# EAGLE design Squid_Leg_Controller (EAGLE 6.4)
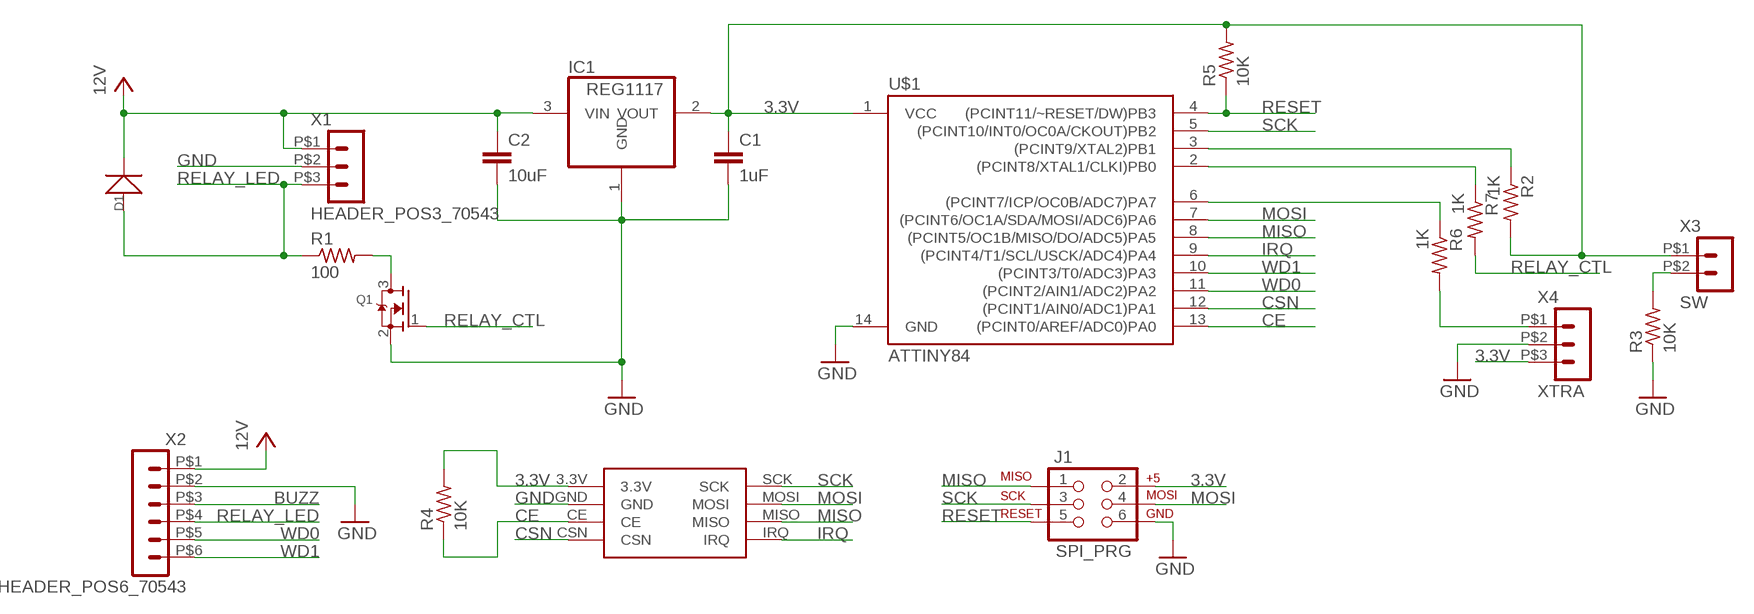
[diagram p0: schematic, sheet 1]

## Parts
C1  1uF  CAP0805  [0805]
C2  10uF  CAP1206  [1206]
D1  D-SMA  [DO-214AC]
IC1  REG1117  [SOT223]
J1  SPI_PRG  AVR_SPI_PRG_62X3_LOCK  [2X3_LOCK]
Q1  MOSFET-NREFLOW  [SOT23]
R1  100  R-US_R0603  [R0603]
R2  1K  R-US_R0603  [R0603]
R3  10K  R-US_R0603  [R0603]
R4  10K  R-US_R0603  [R0603]
R5  10K  R-US_R0603  [R0603]
R6  1K  R-US_R0603  [R0603]
R7  1K  R-US_R0603  [R0603]
U$1  ATTINY84  [SO14]
U$4  NRF24L01+  NRF24L01+_MODULEOFF_BOARD  [NRF24L01+_MODULE_OFFBRD]
X1  HEADER_POS3_70543  [70543-POS3]
X2  HEADER_POS6_70543  [70543-POS6]
X3  SW  HEADER_POS2_70543  [70543-POS2]
X4  XTRA  HEADER_POS3_70543  [70543-POS3]

## Nets
3.3V: C1.1 IC1.2(VOUT) J1.2 R2.2 R4.2 R5.2 U$1.1(VCC) U$4.3.3V X3.P$1 X4.P$3
BUZZ: X2.P$3
CE: R4.1 U$1.13((PCINT0/AREF/ADC0)PA0) U$4.CE
CSN: U$1.12((PCINT1/AIN0/ADC1)PA1) U$4.CSN
GND: C1.2 C2.2 IC1.1(GND) J1.6 Q1.2(S) R3.1 U$1.14(GND) U$4.GND X1.P$2 X2.P$2 X4.P$2
IRQ: U$1.9((PCINT4/T1/SCL/USCK/ADC4)PA4) U$4.IRQ
MISO: J1.1 U$1.8((PCINT5/OC1B/MISO/DO/ADC5)PA5) U$4.MISO
MOSI: J1.4 U$1.7((PCINT6/OC1A/SDA/MOSI/ADC6)PA6) U$4.MOSI
N$1: R2.1 U$1.3((PCINT9/XTAL2)PB1)
N$2: R3.2 X3.P$2
N$3: R6.1 U$1.6((PCINT7/ICP/OC0B/ADC7)PA7)
N$4: R7.1 U$1.2((PCINT8/XTAL1/CLKI)PB0)
N$5: Q1.3(D) R1.2
N$6: R6.2 X4.P$1
RELAY_CTL: Q1.1(G) R7.2
RELAY_LED: D1.1(+) R1.1 X1.P$3 X2.P$4
RESET: J1.5 R5.1 U$1.4((PCINT11/~RESET/DW)PB3)
SCK: J1.3 U$1.5((PCINT10/INT0/OC0A/CKOUT)PB2) U$4.SCK
VCC: C2.1 D1.2(-) IC1.3(VIN) X1.P$1 X2.P$1 ; supply symbol labelled 12V
WD0: U$1.11((PCINT2/AIN1/ADC2)PA2) X2.P$5
WD1: U$1.10((PCINT3/T0/ADC3)PA3) X2.P$6

## Library data of the parts
C1 C2 = SparkFun-Capacitors:CAP: Capacitor Standard 0603 ceramic capacitor, and 0.1" leaded capacitor.
D1 = OPL Eagle Library:D*: DIODE
IC1 = burr-brown:REG1117: 800mA and 1A Low Dropout (LDO) Positive Regulator 1.8V, 2.5V, 2.85V, 3.3V, 5V, and Adj; MPN: REG1117; OC_FARNELL: 1097566; OC_NEWARK: 14P6981
J1 = SparkFun-Connectors:AVR_SPI_PRG_6: AVR ISP 6 Pin This is the reduced ISP connector for AVR programming. Common on Arduino. This footprint will take up less PCB space and can be used with a 10-pin to 6-pin adapter such as SKU: BOB-08508
Q1 = adafruit:MOSFET-N: N-Channel Mosfet 2N7002E - 60V 260mA SOT23 [Digikey: 2N7002ET1GOSTR-ND] - REEL BSH103 - 30V 850mA SOT23 [Digikey: 568-5013-1-ND]
R1-R7 = resistor:R-US_: RESISTOR, American symbol
U$1 = SparkFun-DigitalIC:ATTINY84: Atmel 14-pin 2/4/8kB flash uC
U$4 = Derp - RF:NRF24L01+_MODULE
X1 X4 = Derp - Connectors - Molex SL:HEADER_POS3_?: Molex -C-Grid® / SL Series connector Wire-to-Board 2.54 mm (0.100") pitch header, 3 positions.
X2 = Derp - Connectors - Molex SL:HEADER_POS6_?: Molex -C-Grid® / SL Series connector Wire-to-Board 2.54 mm (0.100") pitch header, 6 positions.
X3 = Derp - Connectors - Molex SL:HEADER_POS2_?: Molex -C-Grid® / SL Series connector Wire-to-Board 2.54 mm (0.100") pitch header, 2 positions.

## Board
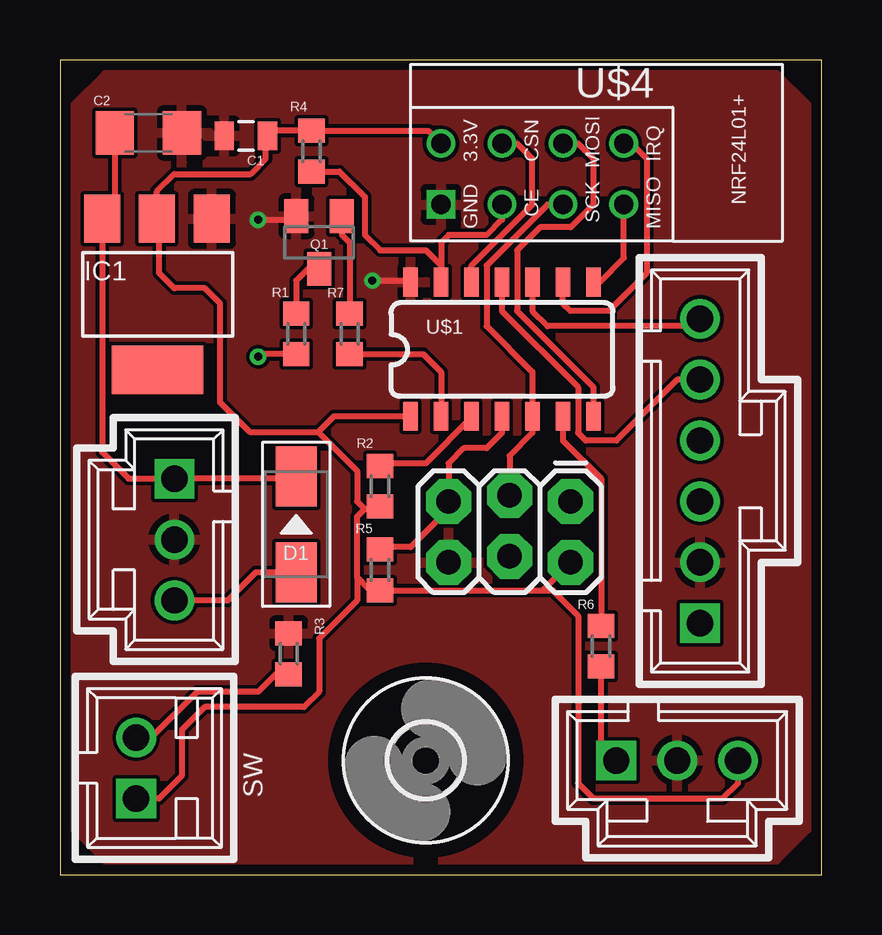
[diagram p1: board, top side]
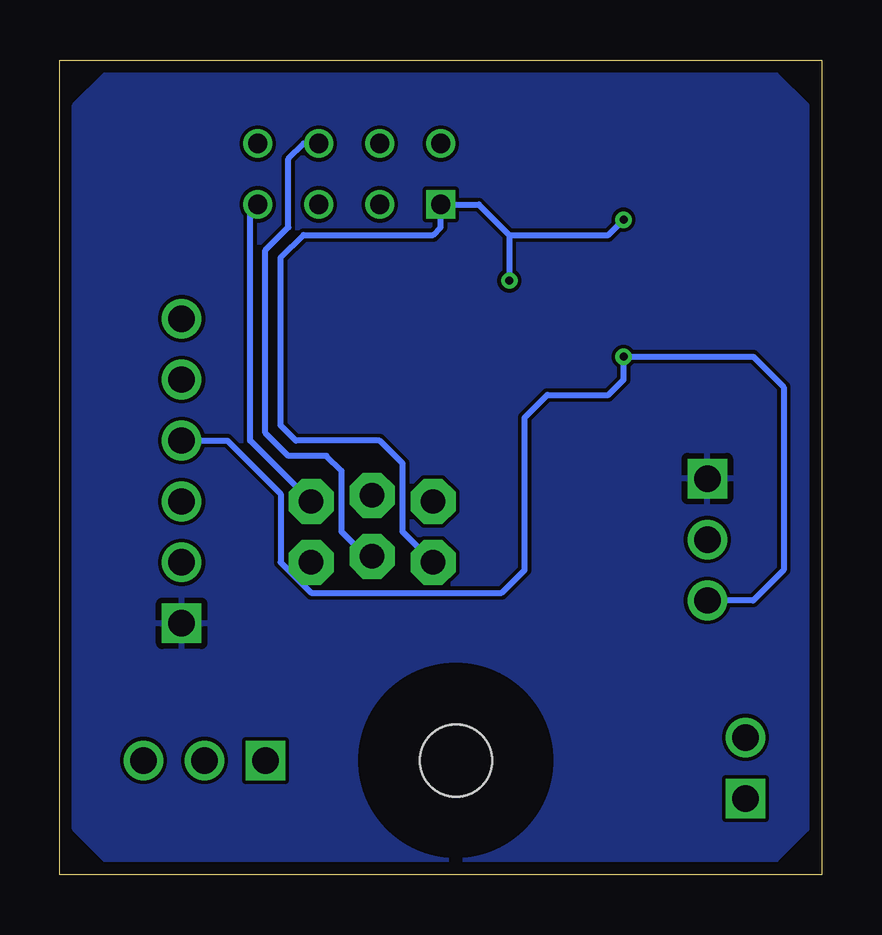
[diagram p2: board, bottom side, seen from below]

Size 31.74 x 33.96 mm. Coordinates in mm from the lower left corner, seen from the top.
Outline: 0,0 31.74,0 31.74,33.96 0,33.96 0,0
Copper layers (1*16): Top 0.0356mm / dielectric 1.5011mm / Bottom 0.0356mm
Design rules "OSHPark": minimum track width 6mil, minimum drill 13mil, track to track 6mil, track to pad 6mil, pad to pad 6mil, via to via 6mil, smd to smd 6mil, copper to edge 15mil, drill to drill 6mil, minimum pad ring 7mil, minimum via ring 7mil, stop-mask expansion 3mil, vias tented up to drill 0mil, thermal gap 10mil

### Footprints (pad centres in the part's own frame; a part is rotated, then mirrored left to right if it is on the bottom)
0805 = smd 0.8 x 1.2: 1 -0.9,0; 2 0.9,0
1206 = smd 1.6 x 1.8: 1 -1.4,0; 2 1.4,0
DO-214AC = smd 2.5 x 1.7: 1 -2,0; 2 2,0
SOT223 = smd 1.499 x 2.007: 1 -2.261,-3.15; 2 0.025,-3.15; 3 2.311,-3.15 | smd 3.81 x 2.007: 4 0,3.15
2X3_LOCK = drill 1.016 pad 1.88 octagon: 1 0,0; 2 0,2.54; 3 2.54,-0.254; 4 2.54,2.286; 5 5.08,0; 6 5.08,2.54
SOT23 = smd 1 x 1.4: 1 -0.95,-1.1; 2 0.95,-1.1; 3 0,1.1
R0603 = smd 1 x 1.1: 1 -0.85,0; 2 0.85,0
SO14 = smd 0.6 x 1.2: 1 -3.81,-2.8; 2 -2.54,-2.8; 3 -1.27,-2.8; 4 0,-2.8; 5 1.27,-2.8; 6 2.54,-2.8; 7 3.81,-2.8; 8 3.81,2.8; 9 2.54,2.8; 10 1.27,2.8; 11 0,2.8; 12 -1.27,2.8; 13 -2.54,2.8; 14 -3.81,2.8
3,0 = hole 3: 0,0
NRF24L01+_MODULE_OFFBRD = drill 0.8: 3.3V -10.16,6.35; CE -12.7,3.81; CSN -10.16,3.81; IRQ -10.16,-1.27; MISO -12.7,-1.27; MOSI -10.16,1.27; SCK -12.7,1.27 | drill 0.8 square: GND -12.7,6.35
70543-POS3 = drill 1.1 square: P$1 2.54,0 | drill 1.1: P$2 0,0; P$3 -2.54,0
70543-POS6 = drill 1.1 square: P$1 6.35,0 | drill 1.1: P$2 3.81,0; P$3 1.27,0; P$4 -1.27,0; P$5 -3.81,0; P$6 -6.35,0
70543-POS2 = drill 1.1 square: P$1 1.27,0 | drill 1.1: P$2 -1.27,0

### Placement (x,y rotation side)
C1  7.75,30.8 180 top
C2  3.68,30.92 0 top
D1  9.84,14.61 90 top
IC1  4.06,24.19 180 top
J1  21.27,15.56 180 top
Q1  10.79,26.35 180 top
R1  9.84,22.54 90 top
R2  13.34,16.19 270 top
R3  9.53,9.21 270 top
R4  10.48,30.16 90 top
R5  13.34,12.7 270 top
R6  22.54,9.53 270 top
R7  12.06,22.54 90 top
U$1  18.41,21.91 0 top
U$2  [3,0]  15.24,4.76 0 top
U$4  22.23,40.64 90 top
X1  4.76,13.97 90 top
X2  26.67,16.83 270 top
X3  3.17,4.45 270 top
X4  25.72,4.76 180 top

### Tracks (layer width: path | path; a pad name or v marks a point on that pad's centre or on a via)
3.3V
  Top 0.254: 12.38,12.38 12.91,11.85 R5.2 20.11,11.85 | 12.38,12.38 12.38,14.92 12.7,15.24 | 12.7,15.24 13.23,15.24 R2.2 | 10.76,18.45 12.38,16.83 12.38,15.56 12.7,15.24 | 20.11,11.85 J1.2 | U$4.3.3V 15.34,31.01 R4.2 8.86,31.01 C1.1 8.57,30.72 8.57,29.84 7.94,29.21 4.76,29.21 4.04,28.49 IC1.2 4.13,27.25 4.13,25.08 4.76,24.45 6.03,24.45 6.67,23.81 6.67,19.68 7.9,18.45 10.76,18.45 | U$1.1 11.41,19.11 10.76,18.45 | 12.38,12.38 12.38,11.43 10.79,9.84 10.79,7.62 10.16,6.99 6.03,6.99 5.08,6.03 5.08,4.13 4.13,3.17 X3.P$1 | 20.11,11.85 20.54,11.85 21.59,10.79 21.59,3.81 22.23,3.17 27.62,3.17 28.26,3.81 X4.P$3
CE
  Top 0.254: R4.1 11.64,29.31 12.7,28.26 12.7,26.67 13.34,26.04 15.24,26.04 15.88,25.4 U$1.13 15.88,26.35 16.19,26.67 17.78,26.67 18.41,27.3 U$4.CE
CSN
  Top 0.254: U$1.12 17.14,25.4 19.68,27.94 19.68,29.84 19.05,30.48 U$4.CSN
GND  (via drill 0.33)
  Top 0.254: v13.02,24.77 14.55,24.77 U$1.14 | v8.26,27.3 9.99,27.3 Q1.2
  Bottom 0.254: 13.02,26.67 14.29,27.94 U$4.GND 15.88,26.99 16.19,26.67 21.59,26.67 22.54,25.72 22.54,18.73 21.91,18.1 18.41,18.1 17.46,17.14 17.46,14.29 J1.6 | 13.02,26.67 v13.02,24.77 | 13.02,26.67 8.89,26.67 v8.26,27.3
  pour Top: 1.91,0.64 29.84,0.64 31.11,1.91 31.11,32.07 29.84,33.34 1.91,33.34 0.64,32.07 0.64,1.91
IRQ
  Top 0.254: U$4.IRQ 23.81,30.48 24.45,29.84 24.45,25.08 22.86,23.5 21.27,23.5 20.95,23.81 U$1.9
MISO
  Top 0.254: U$1.8 22.48,24.71 23.5,25.72 U$4.MISO
  Bottom 0.254: J1.1 23.81,18.1 23.81,27.62 U$4.MISO
MOSI
  Top 0.254: U$4.MOSI 21.59,30.48 22.23,29.84 22.23,27.94 21.27,26.99 20,26.99 19.05,26.04 19.05,23.5 22.23,20.32 U$1.7
  Bottom 0.254: J1.4 18.99,13.27 20,14.29 20,16.83 20.64,17.46 22.23,17.46 23.18,18.41 23.18,26.04 22.23,26.99 22.23,29.84 21.59,30.48 U$4.MOSI
N$1
  Top 0.254: U$1.3 17.14,19.05 15.24,17.14 13.44,17.14 R2.1
N$2
  Top 0.254: R3.2 8.99,8.36 8.26,7.62 5.71,7.62 3.81,5.71 X3.P$2
N$3
  Top 0.254: U$1.6 20.95,18.1 22.54,16.51 R6.1
N$4
  Top 0.254: R7.1 15.14,21.69 15.88,20.95 U$1.2
N$5
  Top 0.254: Q1.3 10.33,25.25 9.84,24.77 R1.2
N$6
  Top 0.254: X4.P$1 22.86,4.76 22.54,5.08 R6.2
RELAY_CTL
  Top 0.254: Q1.1 11.74,26.67 12.06,26.35 R7.2
RELAY_LED  (via drill 0.33)
  Top 0.254: R1.1 8.36,21.69 v8.26,21.59 | D1.1 8.16,12.61 6.99,11.43 X1.P$3
  Bottom 0.254: X1.P$3 2.86,11.43 1.59,12.7 1.59,20.32 2.86,21.59 v8.26,21.59 8.26,20.64 8.89,20 11.43,20 12.38,19.05 12.38,12.7 13.34,11.75 21.27,11.75 22.54,13.02 22.54,15.88 24.77,18.1 X2.P$4
RESET
  Top 0.254: U$1.4 18.41,18.41 17.78,17.78 16.83,17.78 16.19,17.14 J1.5 16.19,15.24 14.61,13.65 13.44,13.65 R5.1
SCK
  Top 0.254: U$4.SCK 20.32,27.94 17.78,25.4 17.78,22.86 19.68,20.95 U$1.5 19.68,18.41 18.73,17.46 J1.3
VCC
  Top 0.254: C2.1 2.28,27.87 IC1.3 1.75,17.61 2.86,16.51 X1.P$1 9.53,16.51 9.53,16.61 D1.2
  pour Bottom: 0.64,32.07 0.64,1.91 1.91,0.64 29.84,0.64 31.11,1.91 31.11,32.07 29.84,33.34 1.91,33.34
WD0
  Top 0.254: U$1.11 18.41,23.5 21.59,20.32 21.59,18.41 21.91,18.1 23.18,18.1 25.72,20.64 X2.P$5
WD1
  Top 0.254: U$1.10 19.68,23.5 20.32,22.86 26.35,22.86 X2.P$6

### Text on the board
tNames: SW